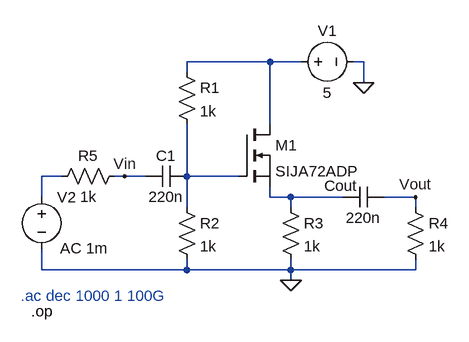
[diagram p0: schematic mosfet_cd.asc]
mosfet_cd.asc, the LTspice schematic file:
Version 4.1
SHEET 1 880 680
WIRE 128 32 0 32
WIRE 176 32 128 32
WIRE 272 32 256 32
WIRE 0 48 0 32
WIRE 272 64 272 32
WIRE 128 128 128 32
WIRE -192 208 -224 208
WIRE -96 208 -112 208
WIRE -64 208 -96 208
WIRE 0 208 0 128
WIRE 80 208 0 208
WIRE -224 240 -224 208
WIRE 128 240 128 224
WIRE 160 240 128 240
WIRE 240 240 160 240
WIRE 352 240 304 240
WIRE 0 256 0 208
WIRE 160 256 160 240
WIRE 352 256 352 240
WIRE -224 352 -224 320
WIRE 0 352 0 336
WIRE 0 352 -224 352
WIRE 160 352 160 336
WIRE 160 352 0 352
WIRE 352 352 352 336
WIRE 352 352 160 352
WIRE 160 368 160 352
FLAG 160 368 0
FLAG 272 64 0
FLAG 352 240 Vout
FLAG -96 208 Vin
SYMBOL nmos 80 128 R0
SYMATTR InstName M1
SYMATTR Value SIJA72ADP
SYMBOL voltage 160 32 R270
WINDOW 0 32 56 VTop 2
WINDOW 3 -32 56 VBottom 2
WINDOW 123 0 0 Left 0
WINDOW 39 0 0 Left 0
SYMATTR InstName V1
SYMATTR Value 5
SYMBOL res -16 32 R0
SYMATTR InstName R1
SYMATTR Value 1k
SYMBOL res -16 240 R0
SYMATTR InstName R2
SYMATTR Value 1k
SYMBOL res 144 240 R0
SYMATTR InstName R3
SYMATTR Value 1k
SYMBOL cap 304 224 R90
WINDOW 0 14 67 VBottom 2
WINDOW 3 32 32 VTop 2
SYMATTR InstName Cout
SYMATTR Value 220n
SYMBOL res 336 240 R0
SYMATTR InstName R4
SYMATTR Value 1k
SYMBOL voltage -224 224 R0
WINDOW 123 29 95 Left 2
WINDOW 39 0 0 Left 0
SYMATTR InstName V2
SYMATTR Value ""
SYMATTR Value2 AC 1m
SYMBOL res -96 192 R90
WINDOW 0 0 56 VBottom 2
WINDOW 3 32 56 VTop 2
SYMATTR InstName R5
SYMATTR Value 1k
SYMBOL cap 0 192 R90
WINDOW 0 0 32 VBottom 2
WINDOW 3 32 32 VTop 2
SYMATTR InstName C1
SYMATTR Value 220n
TEXT -256 392 Left 2 ;.ac dec 1000 1 100G
TEXT -240 416 Left 2 !.op

The netlist it stands for:
* mosfet_cd.asc
M1 N001 N003 N004 N004 SIJA72ADP
V1 N001 0 5
R1 N001 N003 1k
R2 N003 0 1k
R3 N004 0 1k
Cout Vout N004 220n
R4 Vout 0 1k
V2 N002 0 AC 1m
R5 Vin N002 1k
C1 N003 Vin 220n
.model NMOS NMOS
.model PMOS PMOS
.lib standard.mos
* .ac dec 1000 1 100G
.op
.backanno
.end